# Altium schematic sheet WaterMonitor.SchDoc
size 381 x 241 mm; SheetNumber: 1; SheetTotal: 1
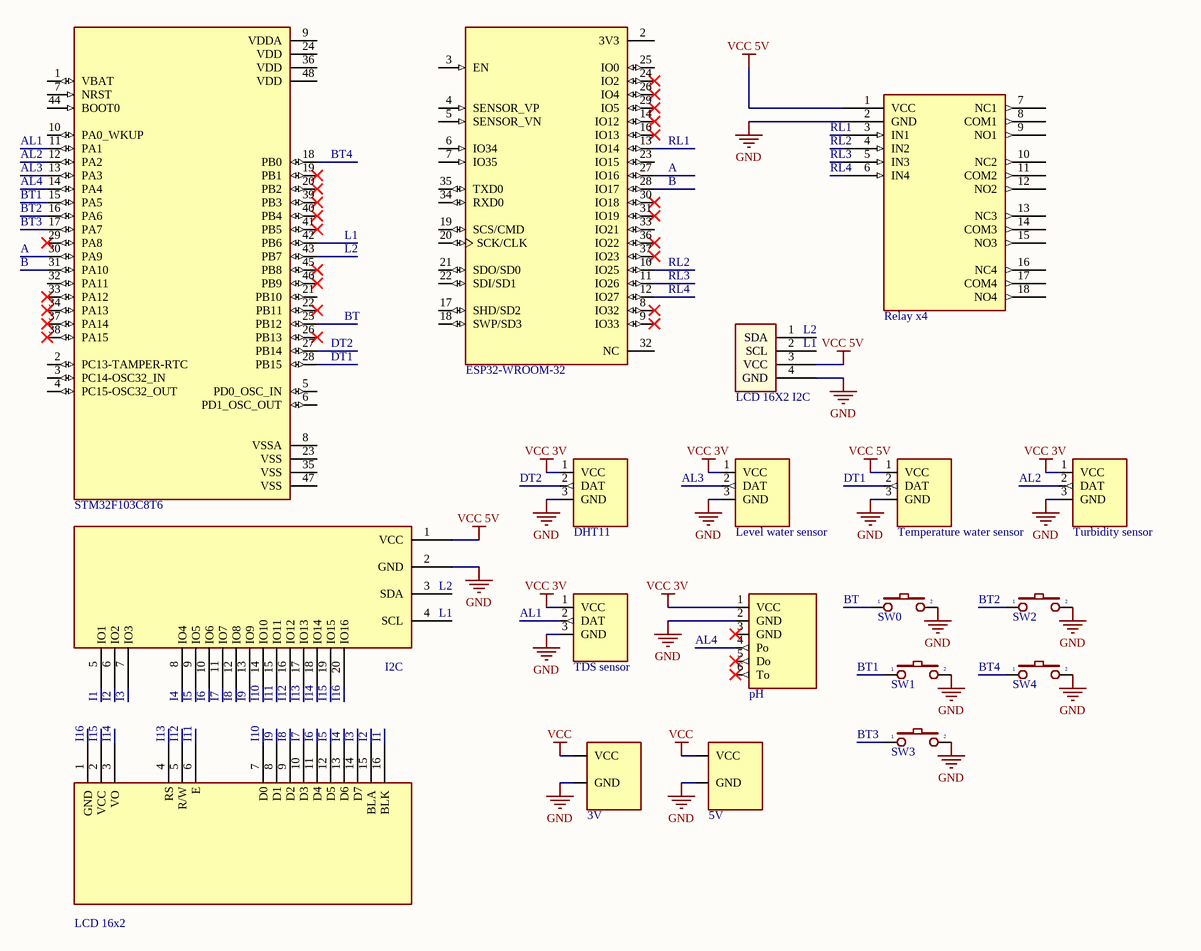
[diagram p0: WaterMonitor.SchDoc]

## Parts
(Parts that share a designator on the sheet are numbered #1, #2 ... from top to bottom, then left to right.)
*#1  Relay x4
*#2  STM32F103C8T6  [STM32F103C8T6]
*#3  Level water sensor
*#4  Turbidity sensor
*#5  DHT11  [DHT11]
*#6  Temperature water sensor
*#7  pH
*#8  TDS sensor
*#9  5V
*#10  LCD 16x2  (part A of 2)
*?  3V
?  I2C
SW?#1  SW0  [SW2]
SW?#2  SW2  [SW2]
SW?#3  SW1  [SW2]
SW?#4  SW4  [SW2]
SW?#5  SW3  [SW2]
U?#1  ESP32-WROOM-32  [ESP32-WROOM-32]
U?#2  LCD 16X2 I2C  [LCD SH1106]

## Nets
GND: *#1.2(GND) *#3.3(GND) *#4.3(GND) *#5.3(GND) *#6.3(GND) *#7.2(GND) *#8.3(GND) *#9.P$4(GND) *?.P$4(GND) ?.2(GND) SW?#1.2 SW?#2.2 SW?#3.2 SW?#4.2 SW?#5.2 U?#2.4(GND)
VCC: *#9.P$1(VCC) *?.P$1(VCC)
VCC 3V: *#3.1(VCC) *#4.1(VCC) *#5.1(VCC) *#7.1(VCC) *#8.1(VCC)
VCC 5V: *#1.1(VCC) *#6.1(VCC) ?.1(VCC) U?#2.3(VCC)

Not connected (* = marked no-connect by the designer): *#1 3(IN1) 4(IN2) 5(IN3) 6(IN4) 7(NC1) 8(_COM1) 9(NO1) 10(NC2) 11(_COM2) 12(NO2) 13(NC3) 14(_COM3) 15(NO3) 16(NC4) 17(_COM4) 18(NO4); *#2 1(VBAT) 2(PC13-TAMPER-RTC) 3(PC14-OSC32_IN) 4(PC15-OSC32_OUT) 5(PD0_OSC_IN) 6(PD1_OSC_OUT) 7(NRST) 8(VSSA) 9(VDDA) 10(PA0_WKUP) 11(PA1) 12(PA2) 13(PA3) 14(PA4) 15(PA5) 16(PA6) 17(PA7) 18(PB0) 19(PB1)* 20(PB2)* 21(PB10) 22(PB11)* 23(VSS) 24(VDD) 25(PB12) 26(PB13)* 27(PB14) 28(PB15) 29(PA8)* 30(PA9) 31(PA10) 32(PA11) 33(PA12)* 34(PA13)* 35(VSS) 36(VDD) 37(PA14)* 38(PA15)* 39(PB3)* 40(PB4)* 41(PB5)* 42(PB6) 43(PB7) 44(BOOT0) 45(PB8)* 46(PB9)* 47(VSS) 48(VDD); *#3 2(DAT); *#4 2(DAT); *#5 2(DAT); *#6 2(DAT); *#7 3(GND)* 4(Po) 5(Do)* 6(To)*; *#8 2(DAT); *#10 1(GND) 2(VCC) 3(VO) 4(RS) 5(R/W) 6(E) 7(D0) 8(D1) 9(D2) 10(D3) 11(D4) 12(D5) 13(D6) 14(D7) 15(BLA) 16(BLK); ? 3(SDA) 4(SCL) 5(IO1) 6(IO2) 7(IO3) 8(IO4) 9(IO5) 10(IO6) 11(IO7) 12(IO8) 13(IO9) 14(IO10) 15(IO11) 16(IO12) 17(IO13) 18(IO14) 19(IO15) 20(IO16); SW?#1 1; SW?#2 1; SW?#3 1; SW?#4 1; SW?#5 1; U?#1 2(3V3) 3(EN) 4(SENSOR_VP) 5(SENSOR_VN) 6(IO34) 7(IO35) 8(IO32)* 9(IO33)* 10(IO25) 11(IO26) 12(IO27) 13(IO14) 14(IO12)* 16(IO13)* 17(SHD/SD2) 18(SWP/SD3) 19(SCS/CMD) 20(SCK/CLK) 21(SDO/SD0) 22(SDI/SD1) 23(IO15) 24(IO2)* 25(IO0) 26(IO4)* 27(IO16) 28(IO17) 29(IO5)* 30(IO18)* 31(IO19)* 32(NC) 33(IO21) 34(RXD0) 35(TXD0) 36(IO22)* 37(IO23)*; U?#2 1(SDA) 2(SCL)

## Notes on the sheet
- (near *#2) AL1
- (near *#2) AL2
- (near *#2) AL3
- (near *#2) BT4
- (near U?#1) A
- (near U?#1) RL1
- (near *#1) RL1
- (near *#1) RL2
- (near *#1) RL3
- (near *#1) RL4
- (near *#2) AL4
- (near *#2) BT1
- (near *#2) BT3
- (near *#2) BT2
- L1
- (near U?#1) B
- (near *#2) A
- (near *#2) B
- L2
- (near U?#1) RL2
- (near U?#1) RL3
- (near U?#1) RL4
- (near *#2) DT1
- (near *#2) DT2
- BT
- (near U?#2) L2
- (near U?#2) L1
- (near *#5) DT2
- (near *#3) AL3
- (near *#6) DT1
- (near *#4) AL2
- (near *#8) AL1
- (near *#7) AL4
- (near SW?#1) BT
- (near SW?#2) BT2
- I1
- I2
- I3
- I4
- I5
- I6
- I7
- I8
- I9
- I10
- I11
- I12
- I13
- I14
- I15
- I16
- (near SW?#3) BT1
- (near SW?#4) BT4
- (near *#10) I16
- (near *#10) I15
- (near *#10) I14
- (near *#10) I13
- (near *#10) I12
- (near *#10) I11
- (near *#10) I10
- (near *#10) I9
- (near *#10) I8
- (near *#10) I7
- (near *#10) I6
- (near *#10) I5
- (near *#10) I4
- (near *#10) I3
- (near *#10) I2
- (near *#10) I1
- (near SW?#5) BT3

## Library data of the parts
*? = 5V
SW?#1-SW?#5 = SW2: Switch button 2 pin; Value: SW chip 2 pin
U?#1 = ESP32-WROOM-32: Bluetooth, WiFi 802.11b/g/n, Bluetooth v4.2 +EDR, Class 1, 2 and 3 Transceiver Module 2.4GHz ~ 2.5GHz Antenna Not Included, U.FL Surface Mount
U?#2 = LCD SH1106